# EAGLE design Stamp_Board (EAGLE 8.0.0)
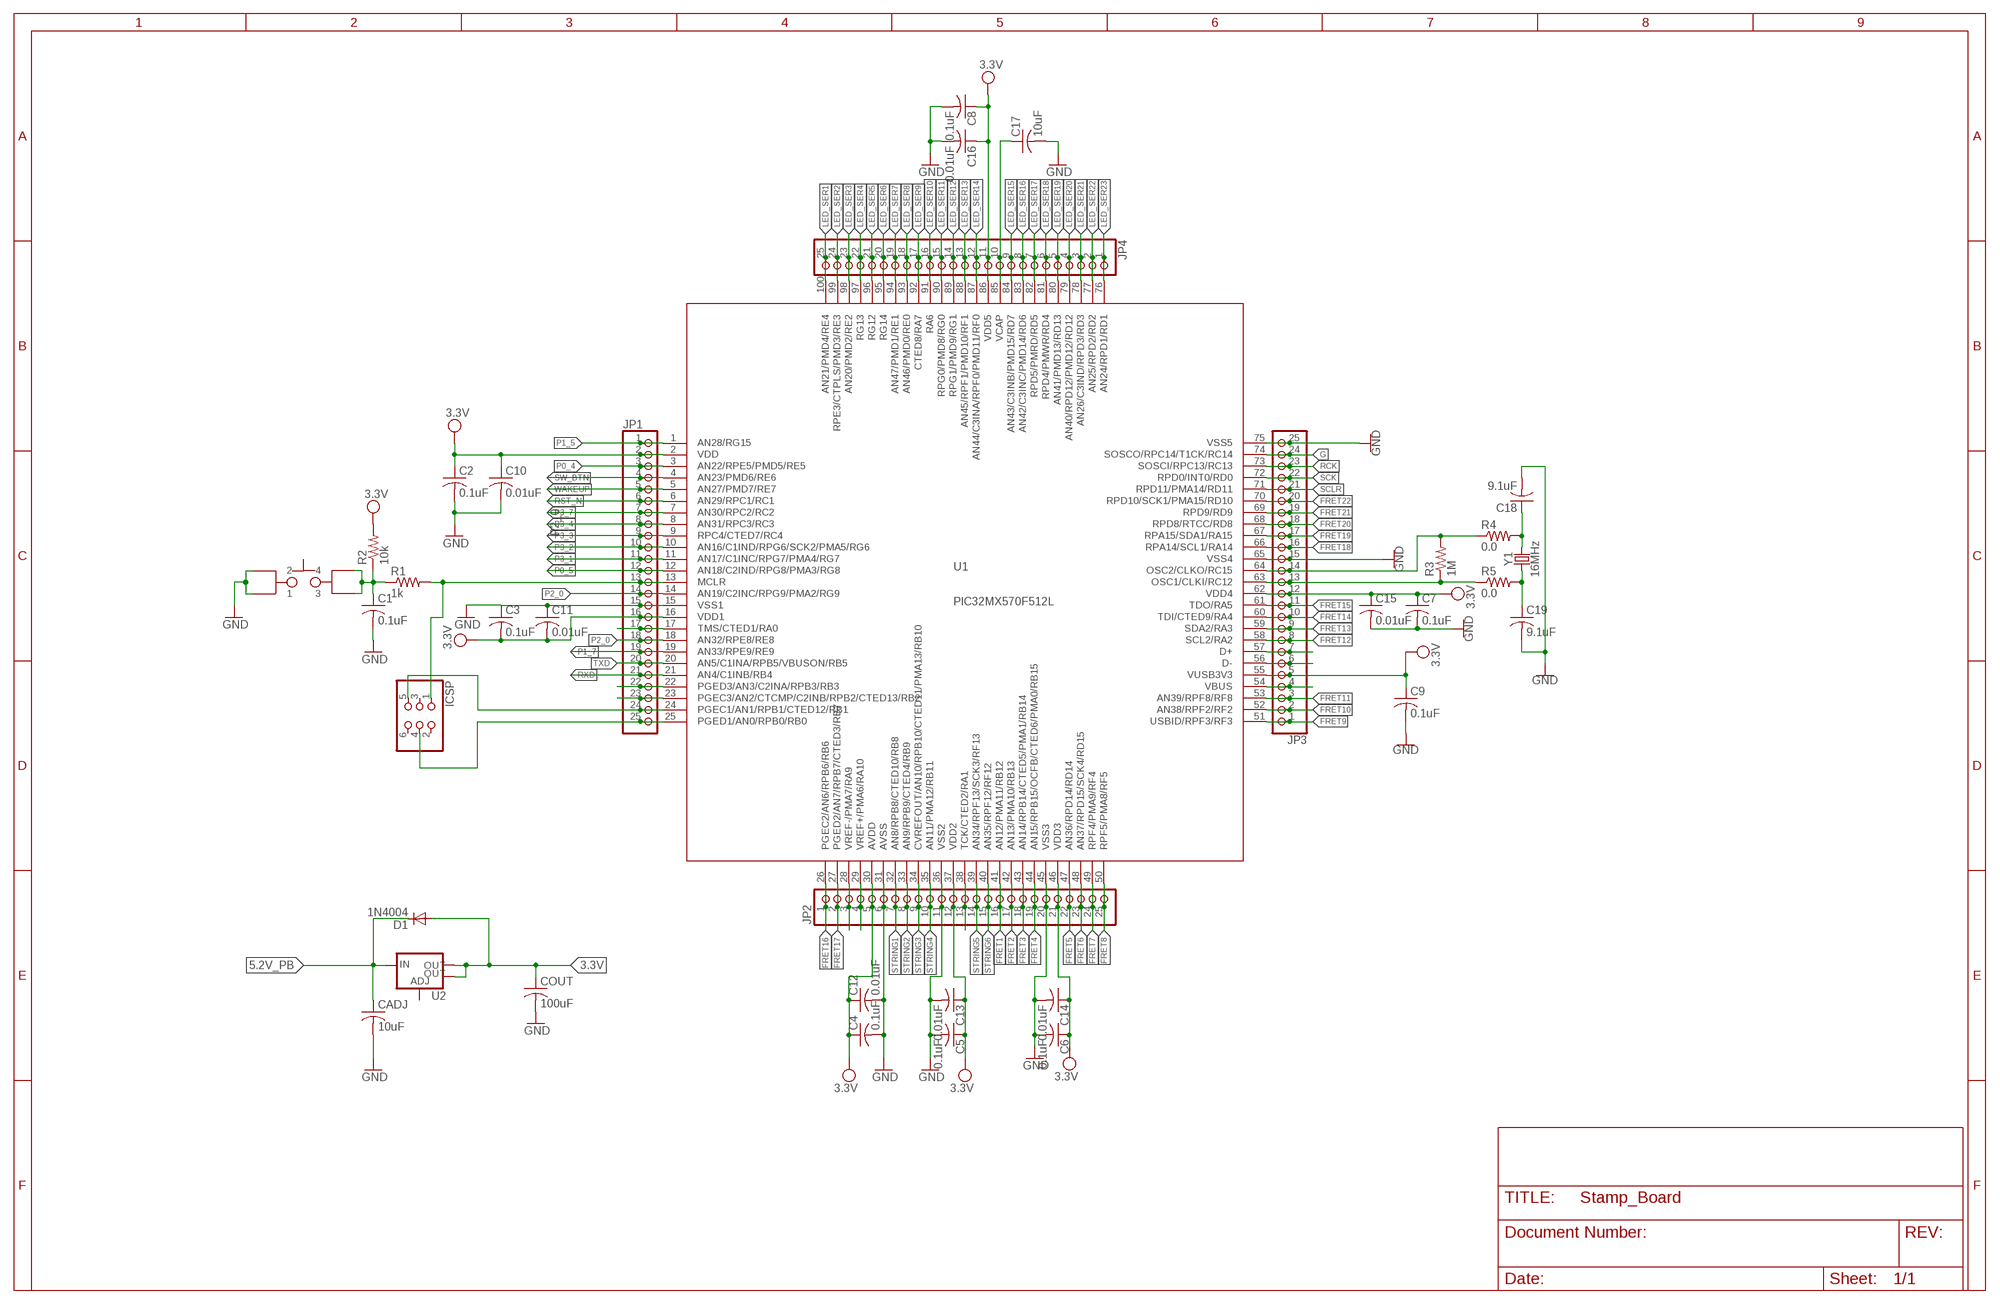
[diagram p0: schematic, sheet 1]

## Parts
C1  0.1uF  C-USC0805  [C0805]
C2  0.1uF  C-USC0805  [C0805]
C3  0.1uF  C-USC0805  [C0805]
C4  0.1uF  C-USC0805  [C0805]
C5  0.1uF  C-USC0805  [C0805]
C6  0.1uF  C-USC0805  [C0805]
C7  0.1uF  C-USC0805  [C0805]
C8  0.1uF  C-USC0805  [C0805]
C9  0.1uF  C-USC0805  [C0805]
C10  0.01uF  C-USC0805  [C0805]
C11  0.01uF  C-USC0805  [C0805]
C12  0.01uF  C-USC0805  [C0805]
C13  0.01uF  C-USC0805  [C0805]
C14  0.01uF  C-USC0805  [C0805]
C15  0.01uF  C-USC0805  [C0805]
C16  0.01uF  C-USC0805  [C0805]
C17  10uF  C-USC0805  [C0805]
C18  9.1uF  C-USC0805  [C0805]
C19  9.1uF  C-USC0805  [C0805]
CADJ  10uF  C-USC0805  [C0805]
COUT  100uF  C-USC0805  [C0805]
D1  1N4004  [DO41-10]
ICSP  PINHD-2X3  [2X03]
JP1  PINHD-1X25  [1X25]
JP2  PINHD-1X25  [1X25]
JP3  PINHD-1X25  [1X25]
JP4  PINHD-1X25  [1X25]
R1  1k  R-US_M0805  [M0805]
R2  10k  R-US_M0805  [M0805]
R3  1M  R-US_M0805  [M0805]
R4  0.0  R-US_R0805  [R0805]
R5  0.0  R-US_R0805  [R0805]
S1  LL3301NF065QG  [LL3301NF065QG]
U1  PIC32MX570F512L  [TQFP100-14X14]
U2  V_REG_LM1117SOT223  [SOT223]
Y1  16MHz  CRYSTALSMD-5X3.2-2PAD  [CRYSTAL-SMD-5X3.2-2PAD]

## Nets
3.3V: COUT.1 D1.A U2.2(OUT) U2.4(OUT)
5.2V_PB: CADJ.1 D1.C U2.3(IN)
FRET1: JP2.16 U1.41(AN12/PMA11/RB12)
FRET2: JP2.17 U1.42(AN13/PMA10/RB13)
FRET3: JP2.18 U1.43(AN14/RPB14/CTED5/PMA1/RB14)
FRET4: JP2.19 U1.44(AN15/RPB15/OCFB/CTED6/PMA0/RB15)
FRET5: JP2.22 U1.47(AN36/RPD14/RD14)
FRET6: JP2.23 U1.48(AN37/RPD15/SCK4/RD15)
FRET7: JP2.24 U1.49(RPF4/PMA9/RF4)
FRET8: JP2.25 U1.50(RPF5/PMA8/RF5)
FRET9: JP3.1 U1.51(USBID/RPF3/RF3)
FRET10: JP3.2 U1.52(AN38/RPF2/RF2)
FRET11: JP3.3 U1.53(AN39/RPF8/RF8)
FRET12: JP3.8 U1.58(SCL2/RA2)
FRET13: JP3.9 U1.59(SDA2/RA3)
FRET14: JP3.10 U1.60(TDI/CTED9/RA4)
FRET15: JP3.11 U1.61(TDO/RA5)
FRET16: JP2.1 U1.26(PGEC2/AN6/RPB6/RB6)
FRET17: JP2.2 U1.27(PGED2/AN7/RPB7/CTED3/RB7)
FRET18: JP3.16 U1.66(RPA14/SCL1/RA14)
FRET19: JP3.17 U1.67(RPA15/SDA1/RA15)
FRET20: JP3.18 U1.68(RPD8/RTCC/RD8)
FRET21: JP3.19 U1.69(RPD9/RD9)
FRET22: JP3.20 U1.70(RPD10/SCK1/PMA15/RD10)
G: JP3.24 U1.74(SOSCO/RPC14/T1CK/RC14)
GND: C1.2 C2.2 C3.1 C4.2 C5.2 C6.2 C7.2 C8.2 C9.2 C10.2 C11.1 C12.2 C13.2 C14.2 C15.2 C16.2 C17.2 C18.2 C19.2 CADJ.2 COUT.2 JP1.15 JP2.6 JP2.11 JP2.20 JP3.15 JP3.25 S1.P$1 S1.P$2 U1.15(VSS1) U1.31(AVSS) U1.36(VSS2) U1.45(VSS3) U1.65(VSS4) U1.75(VSS5)
LED_SER1: JP4.25 U1.100(AN21/PMD4/RE4)
LED_SER2: JP4.24 U1.99(RPE3/CTPLS/PMD3/RE3)
LED_SER3: JP4.23 U1.98(AN20/PMD2/RE2)
LED_SER4: JP4.22 U1.97(RG13)
LED_SER5: JP4.21 U1.96(RG12)
LED_SER6: JP4.20 U1.95(RG14)
LED_SER7: JP4.19 U1.94(AN47/PMD1/RE1)
LED_SER8: JP4.18 U1.93(AN46/PMD0/RE0)
LED_SER9: JP4.17 U1.92(CTED8/RA7)
LED_SER10: JP4.16 U1.91(RA6)
LED_SER11: JP4.15 U1.90(RPG0/PMD8/RG0)
LED_SER12: JP4.14 U1.89(RPG1/PMD9/RG1)
LED_SER13: JP4.13 U1.88(AN45/RPF1/PMD10/RF1)
LED_SER14: JP4.12 U1.87(AN44/C3INA/RPF0/PMD11/RF0)
LED_SER15: JP4.9 U1.84(AN43/C3INB/PMD15/RD7)
LED_SER16: JP4.8 U1.83(AN42/C3INC/PMD14/RD6)
LED_SER17: JP4.7 U1.82(RPD5/PMRD/RD5)
LED_SER18: JP4.6 U1.81(RPD4/PMWR/RD4)
LED_SER19: JP4.5 U1.80(AN41/PMD13/RD13)
LED_SER20: JP4.4 U1.79(AN40/RPD12/PMD12/RD12)
LED_SER21: JP4.3 U1.78(AN26/C3IND/RPD3/RD3)
LED_SER22: JP4.2 U1.77(AN25/RPD2/RD2)
LED_SER23: JP4.1 U1.76(AN24/RPD1/RD1)
N$1: JP3.14 R3.2 R4.1 U1.64(OSC2/CLKO/RC15)
N$2: ICSP.5 JP1.24 U1.24(PGEC1/AN1/RPB1/CTED12/RB1)
N$3: JP1.17 U1.17(TMS/CTED1/RA0)
N$4: JP1.22 U1.22(PGED3/AN3/C2INA/RPB3/RB3)
N$5: JP1.23 U1.23(PGEC3/AN2/CTCMP/C2INB/RPB2/CTED13/RB2)
N$6: C18.1 R4.2 Y1.P$2
N$8: C19.1 R5.2 Y1.P$1
N$12: C17.1 JP4.10 U1.85(VCAP)
N$13: ICSP.1 JP1.13 R1.2 U1.13(MCLR)
N$14: ICSP.4 JP1.25 U1.25(PGED1/AN0/RPB0/RB0)
N$15: JP3.13 R3.1 R5.1 U1.63(OSC1/CLKI/RC12)
N$16: C1.1 R1.1 R2.1 S1.P$3 S1.P$4
N$44: JP2.3 U1.28(VREF-/PMA7/RA9)
N$45: JP2.4 U1.29(VREF+/PMA6/RA10)
N$52: JP2.13 U1.38(TCK/CTED2/RA1)
N$66: JP3.4 U1.54(VBUS)
N$67: JP3.6 U1.56(D-)
N$68: JP3.7 U1.57(D+)
P0_4: JP1.3 U1.3(AN22/RPE5/PMD5/RE5)
P0_5: JP1.12 U1.12(AN18/C2IND/RPG8/PMA3/RG8)
P1_5: JP1.1 U1.1(AN28/RG15)
P1_7: JP1.19 U1.19(AN33/RPE9/RE9)
P2_0: JP1.14 JP1.18 U1.14(AN19/C2INC/RPG9/PMA2/RG9) U1.18(AN32/RPE8/RE8)
P3_1: JP1.11 U1.11(AN17/C1INC/RPG7/PMA4/RG7)
P3_2: JP1.10 U1.10(AN16/C1IND/RPG6/SCK2/PMA5/RG6)
P3_3: JP1.9 U1.9(RPC4/CTED7/RC4)
P3_4: JP1.8 U1.8(AN31/RPC3/RC3)
P3_7: JP1.7 U1.7(AN30/RPC2/RC2)
RCK: JP3.23 U1.73(SOSCI/RPC13/RC13)
RST_N: JP1.6 U1.6(AN29/RPC1/RC1)
RXD: JP1.21 U1.21(AN4/C1INB/RB4)
SCK: JP3.22 U1.72(RPD0/INT0/RD0)
SCLR: JP3.21 U1.71(RPD11/PMA14/RD11)
STRING1: JP2.7 U1.32(AN8/RPB8/CTED10/RB8)
STRING2: JP2.8 U1.33(AN9/RPB9/CTED4/RB9)
STRING3: JP2.9 U1.34(CVREFOUT/AN10/RPB10/CTED11/PMA13/RB10)
STRING4: JP2.10 U1.35(AN11/PMA12/RB11)
STRING5: JP2.14 U1.39(AN34/RPF13/SCK3/RF13)
STRING6: JP2.15 U1.40(AN35/RPF12/RF12)
SW_BTN: JP1.4 U1.4(AN23/PMD6/RE6)
TXD: JP1.20 U1.20(AN5/C1INA/RPB5/VBUSON/RB5)
VDD: C2.1 C3.2 C4.1 C5.1 C6.1 C7.1 C8.1 C9.1 C10.1 C11.2 C12.1 C13.1 C14.1 C15.1 C16.1 JP1.2 JP1.16 JP2.5 JP2.12 JP2.21 JP3.5 JP3.12 JP4.11 R2.2 U1.2(VDD) U1.16(VDD1) U1.30(AVDD) U1.37(VDD2) U1.46(VDD3) U1.55(VUSB3V3) U1.62(VDD4) U1.86(VDD5) ; supply symbol labelled 3.3V
WAKEUP: JP1.5 U1.5(AN27/PMD7/RE7)
Unconnected: ICSP.2 ICSP.3 ICSP.6 U2.1(ADJ)

## Library data of the parts
C1-C19 CADJ COUT = rcl:C-US: CAPACITOR, American symbol
D1 = diode:1N4004: DIODE general purpose rectifier, 1 A
ICSP = pinhead:PINHD-2X3: PIN HEADER
JP1-JP4 = pinhead:PINHD-1X25: PIN HEADER
R1-R5 = rcl:R-US_: RESISTOR, American symbol
S1 = ECE477_Guitutar:LL3301NF065QG
U1 = PICMX5xx:PIC32MX570F512L
U2 = SparkFun-IC-Power:V_REG_LM1117: Voltage Regulator LM1117 Standard adjustable voltage regulator but in SMD form. Spark Fun Electronics SKU : COM-00595; PROD_ID: VREG-08170
Y1 = SparkFun-Clocks:CRYSTAL: Crystals (Generic) These are passive quartz crystals, which can be used as a clock source for a microcontroller. Crystal's are two-terminal devices. They require external "load" capacitors to generate an oscillating signal.

## Board
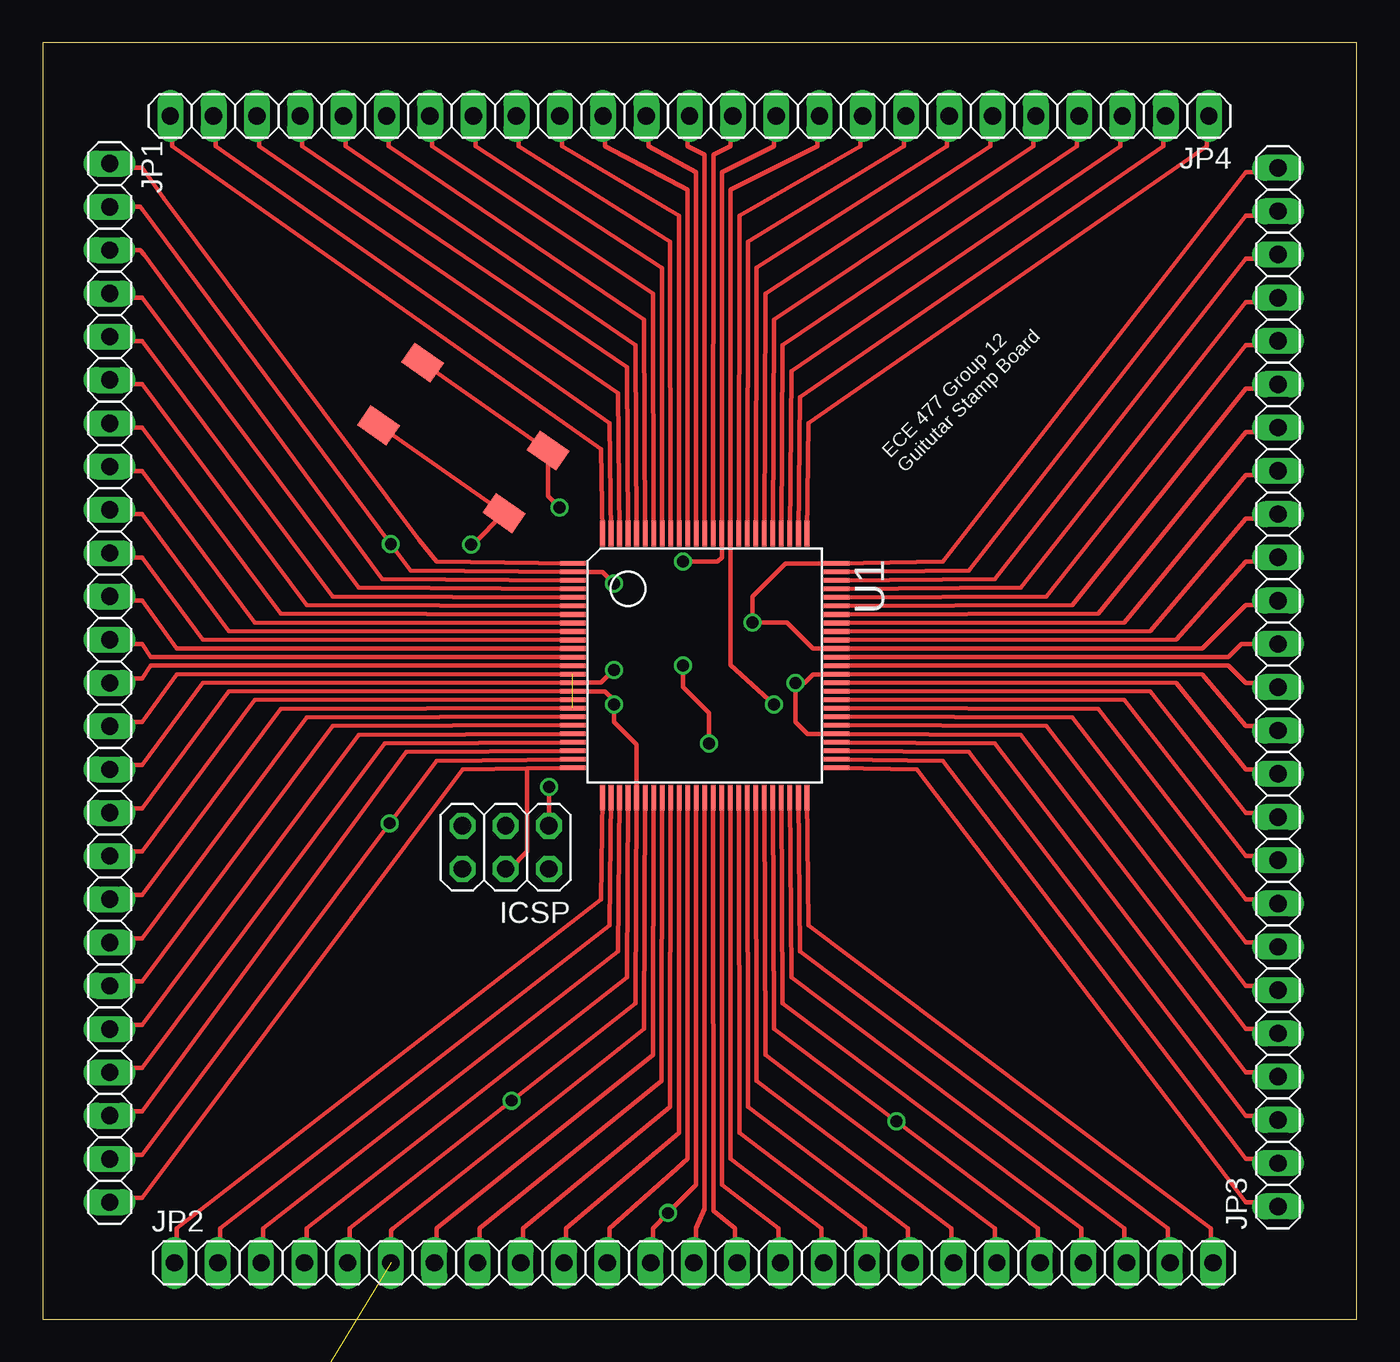
[diagram p1: board, top side]
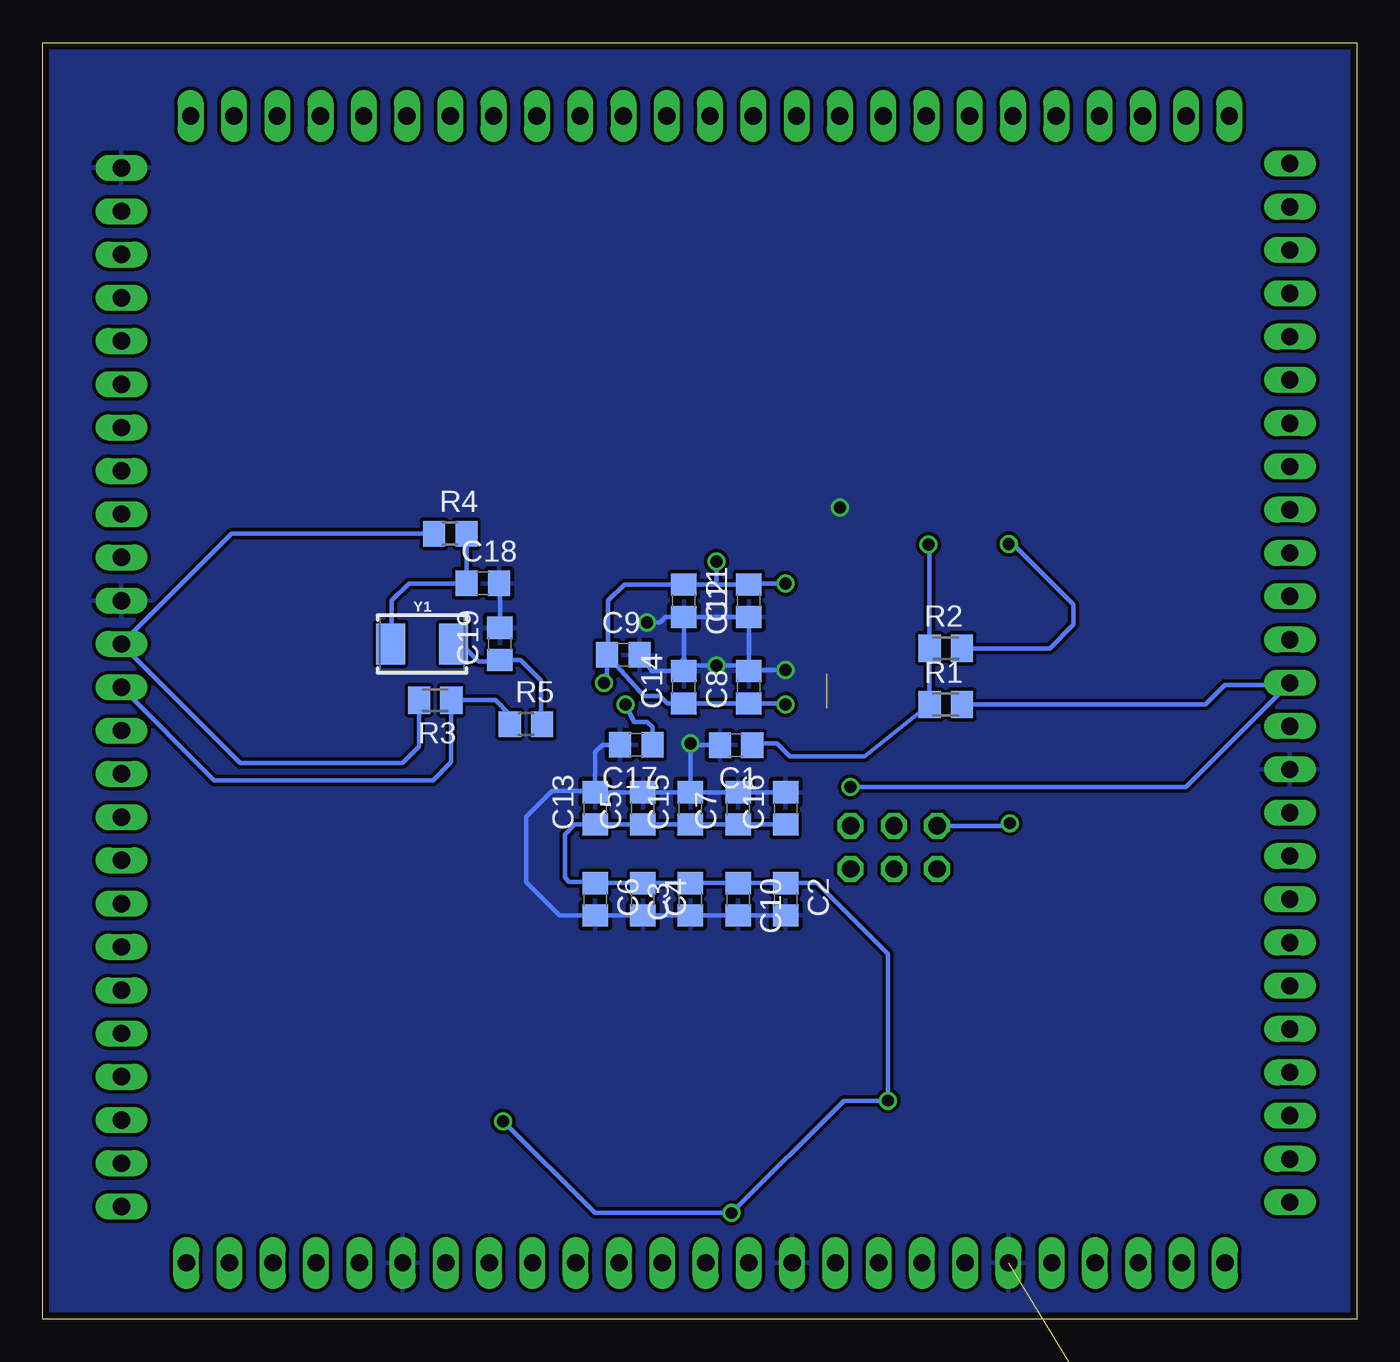
[diagram p2: board, bottom side, seen from below]

Size 77.14 x 74.92 mm. Coordinates in mm from the lower left corner, seen from the top.
Outline: 0,0 77.14,0 77.14,74.92 0,74.92 0,0
Copper layers (1*16): Top 0.0356mm / dielectric 1.5011mm / Bottom 0.0356mm
Design rules "ECE_Senior_Design": minimum track width 8mil, minimum drill 13mil, track to track 8mil, track to pad 8mil, pad to pad 6mil, via to via 8mil, smd to smd 6mil, copper to edge 15mil, drill to drill 8mil, minimum pad ring 7mil, minimum via ring 7mil, stop-mask expansion 3mil, vias tented up to drill 0mil, thermal gap 10mil

### Footprints (pad centres in the part's own frame; a part is rotated, then mirrored left to right if it is on the bottom)
C0805 = smd 1.3 x 1.5: 1 -0.95,0; 2 0.95,0
DO41-10 = drill 1.118: A 5.08,0; C -5.08,0
2X03 = drill 1.016 octagon: 1 -2.54,-1.27; 2 -2.54,1.27; 3 0,-1.27; 4 0,1.27; 5 2.54,-1.27; 6 2.54,1.27
1X25 = drill 1.016 long: 1 -29.21,0; 2 -26.67,0; 3 -24.13,0; 4 -21.59,0; 5 -19.05,0; 6 -16.51,0; 7 -13.97,0; 8 -11.43,0; 9 -8.89,0; 10 -6.35,0; 11 -3.81,0; 12 -1.27,0; 13 1.27,0; 14 3.81,0; 15 6.35,0; 16 8.89,0; 17 11.43,0; 18 13.97,0; 19 16.51,0; 20 19.05,0; 21 21.59,0; 22 24.13,0; 23 26.67,0; 24 29.21,0; 25 31.75,0
M0805 = smd 1.3 x 1.6: 1 -0.95,0; 2 0.95,0
R0805 = smd 1.3 x 1.5: 1 -0.95,0; 2 0.95,0
LL3301NF065QG = smd 2.1 x 1.4: P$1 -4.4,2.2; P$2 4.6,2.2; P$3 -4.4,-2.3; P$4 4.6,-2.3
TQFP100-14X14 = smd 0.27 x 1.5: 1 -6,-7.75; 2 -5.5,-7.75; 3 -5,-7.75; 4 -4.5,-7.75; 5 -4,-7.75; 6 -3.5,-7.75; 7 -3,-7.75; 8 -2.5,-7.75; 9 -2,-7.75; 10 -1.5,-7.75; 11 -1,-7.75; 12 -0.5,-7.75; 13 0,-7.75; 14 0.5,-7.75; 15 1,-7.75; 16 1.5,-7.75; 17 2,-7.75; 18 2.5,-7.75; 19 3,-7.75; 20 3.5,-7.75; 21 4,-7.75; 22 4.5,-7.75; 23 5,-7.75; 24 5.5,-7.75; 25 6,-7.75; 51 6,7.75; 52 5.5,7.75; 53 5,7.75; 54 4.5,7.75; 55 4,7.75; 56 3.5,7.75; 57 3,7.75; 58 2.5,7.75; 59 2,7.75; 60 1.5,7.75; 61 1,7.75; 62 0.5,7.75; 63 0,7.75; 64 -0.5,7.75; 65 -1,7.75; 66 -1.5,7.75; 67 -2,7.75; 68 -2.5,7.75; 69 -3,7.75; 70 -3.5,7.75; 71 -4,7.75; 72 -4.5,7.75; 73 -5,7.75; 74 -5.5,7.75; 75 -6,7.75 | smd 1.5 x 0.27: 26 7.75,-6; 27 7.75,-5.5; 28 7.75,-5; 29 7.75,-4.5; 30 7.75,-4; 31 7.75,-3.5; 32 7.75,-3; 33 7.75,-2.5; 34 7.75,-2; 35 7.75,-1.5; 36 7.75,-1; 37 7.75,-0.5; 38 7.75,0; 39 7.75,0.5; 40 7.75,1; 41 7.75,1.5; 42 7.75,2; 43 7.75,2.5; 44 7.75,3; 45 7.75,3.5; 46 7.75,4; 47 7.75,4.5; 48 7.75,5; 49 7.75,5.5; 50 7.75,6; 76 -7.75,6; 77 -7.75,5.5; 78 -7.75,5; 79 -7.75,4.5; 80 -7.75,4; 81 -7.75,3.5; 82 -7.75,3; 83 -7.75,2.5; 84 -7.75,2; 85 -7.75,1.5; 86 -7.75,1; 87 -7.75,0.5; 88 -7.75,0; 89 -7.75,-0.5; 90 -7.75,-1; 91 -7.75,-1.5; 92 -7.75,-2; 93 -7.75,-2.5; 94 -7.75,-3; 95 -7.75,-3.5; 96 -7.75,-4; 97 -7.75,-4.5; 98 -7.75,-5; 99 -7.75,-5.5; 100 -7.75,-6
SOT223 = smd 1.219 x 2.235: 1 -2.311,-3.099; 2 0,-3.099; 3 2.311,-3.099 | smd 3.6 x 2.2: 4 0,3.099
CRYSTAL-SMD-5X3.2-2PAD = smd 1.7 x 2.4: P$1 1.85,0; P$2 -1.85,0

### Placement (x,y rotation side)
C1  36.44,33.68 180 bottom
C2  33.53,24.64 270 bottom
C3  39.12,24.64 90 bottom
C4  41.91,24.64 270 bottom
C5  41.91,29.97 90 bottom
C6  44.7,24.64 270 bottom
C7  36.32,29.97 90 bottom
C8  35.69,37.08 90 bottom
C9  43.05,38.99 0 bottom
C10  36.32,24.64 270 bottom
C11  35.69,42.16 90 bottom
C12  39.5,42.16 270 bottom
C13  44.7,29.97 90 bottom
C14  39.5,37.08 90 bottom
C15  39.12,29.97 90 bottom
C16  33.53,29.97 90 bottom
C17  42.3,33.7 180 bottom
C18  51.31,43.18 0 bottom
C19  50.29,39.62 90 bottom
CADJ  -1.65,-37.59 0 top  (outside the outline)
COUT  -1.65,-31.5 0 top  (outside the outline)
D1  9.78,-49.02 0 top  (outside the outline)
ICSP  27.18,27.69 180 top
JP1  3.94,38.61 270 top
JP2  36.96,3.3 0 top
JP3  72.52,35.81 90 top
JP4  39.24,70.61 180 top
R1  24.13,36.07 0 bottom
R2  24.13,39.37 0 bottom
R3  54.1,36.32 180 bottom
R4  53.21,46.1 0 bottom
R5  48.77,34.92 0 bottom
S1  24.64,51.82 325 top
U1  38.86,38.35 270 top
U2  2.41,-9.4 0 top  (outside the outline)
Y1  54.86,39.62 0 bottom

### Tracks (layer width: path | path; a pad name or v marks a point on that pad's centre or on a via)
3.3V  (3 unrouted)
5.2V_PB  (2 unrouted)
FRET1
  Top 0.254: JP2.16 45.72,3.43 45.72,5.33 40.39,9.4 U1.41
FRET2
  Top 0.254: JP2.17 48.26,3.43 48.26,5.33 40.89,10.92 U1.42
FRET3
  Top 0.254: JP2.18 50.8,3.43 50.8,5.33 41.4,12.45 U1.43
FRET4
  Top 0.254: JP2.19 53.34,3.43 53.34,5.33 41.91,13.97 U1.44
FRET5
  Top 0.254: JP2.22 60.96,3.43 60.96,5.33 43.43,18.54 U1.47
FRET6
  Top 0.254: JP2.23 63.5,3.43 63.5,5.33 43.94,20.07 U1.48
FRET7
  Top 0.254: JP2.24 66.04,3.43 66.04,5.33 44.45,21.59 U1.49
FRET8
  Top 0.254: JP2.25 68.58,3.43 68.58,5.33 44.96,23.11 U1.50
FRET9
  Top 0.254: JP3.1 72.26,6.86 70.61,6.86 51.31,32.26 U1.51
FRET10
  Top 0.254: JP3.2 72.26,9.4 70.61,9.4 52.83,32.77 U1.52
FRET11
  Top 0.254: JP3.3 72.26,11.94 70.61,11.94 54.36,33.27 U1.53
FRET12
  Top 0.254: JP3.8 72.26,24.64 70.61,24.64 61.98,35.81 U1.58
FRET13
  Top 0.254: JP3.9 72.26,27.18 70.61,27.18 63.5,36.32 U1.59
FRET14
  Top 0.254: JP3.10 72.26,29.72 70.61,29.72 65.02,36.83 U1.60
FRET15
  Top 0.254: JP3.11 72.26,32.26 70.61,32.26 66.55,37.34 U1.61
FRET16
  Top 0.254: JP2.1 7.87,3.43 7.87,5.33 32.77,24.64 U1.26
FRET17
  Top 0.254: JP2.2 10.41,3.43 10.41,5.33 33.27,23.11 U1.27
FRET18
  Top 0.254: JP3.16 72.26,44.45 70.61,44.45 66.55,39.88 U1.66
FRET19
  Top 0.254: JP3.17 72.26,46.99 70.61,46.99 65.02,40.39 U1.67
FRET20
  Top 0.254: JP3.18 72.26,49.53 70.61,49.53 63.5,40.89 U1.68
FRET21
  Top 0.254: JP3.19 72.26,52.07 70.61,52.07 61.98,41.4 U1.69
FRET22
  Top 0.254: JP3.20 72.26,54.61 70.61,54.61 60.45,41.91 U1.70
G
  Top 0.254: JP3.24 72.26,64.77 70.61,64.77 54.36,43.94 U1.74
GND  (via drill 0.7)  (2 unrouted)
  Top 0.254: S1.P$1 S1.P$2 29.67,48.31 v30.35,47.62 | JP1.15 4.19,32.51 5.84,32.51 9.4,37.34 U1.15 32.78,37.35 v33.53,38.1 | U1.31 35.31,17.02 33.84,15.86 20.57,5.33 20.45,5.21 JP2.6 | JP2.20 55.88,3.43 55.88,5.33 45.3,13.32 42.42,15.49 U1.45 | JP2.11 33.27,3.43 33.27,5.33 36.9,8.56 37.85,9.4 U1.36 | JP3.25 72.26,67.31 70.61,67.31 52.83,44.45 U1.75 43.59,44.35 41.66,42.42 v41.66,40.89 43.69,40.89 45.23,39.35 U1.65 68.07,39.37 70.61,41.91 72.26,41.91 JP3.15 | v39.12,33.78 39.12,35.56 37.59,37.08 v37.59,38.35
  Bottom 0.254: C2.2 C10.2 C3.1 C4.2 C6.2 46.8,23.69 48.77,25.65 48.77,29.46 47.24,30.99 44.77,30.99 C13.2 | C13.2 C5.2 C15.2 | C15.2 C7.2 C16.2 | 38.91,31.13 C15.2 | C17.2 44.27,33.7 44.7,33.27 C13.2 | C8.2 C11.1 C12.2 | C14.2 C12.2 | C12.2 40.57,41.21 40.89,40.89 v41.66,40.89 | C14.2 41.4,38.03 C9.2 | v33.53,38.1 35.62,38.1 C8.2 | C19.2 50.29,43.11 C18.2 | C1.2 39.02,33.68 v39.12,33.78 C15.2 | C8.2 36.01,38.35 v37.59,38.35 39.18,38.35 C14.2
  Bottom 0.406: C14.2 39.5,38.67
  pour Bottom: 0,0 0,74.93 77.22,74.93 77.22,0
LED_SER1
  Top 0.254: JP4.25 7.62,70.48 7.62,68.83 32.77,51.05 U1.100
LED_SER2
  Top 0.254: JP4.24 10.16,70.48 10.16,68.83 33.27,52.58 U1.99
LED_SER3
  Top 0.254: JP4.23 12.7,70.48 12.7,68.83 33.78,54.36 U1.98
LED_SER4
  Top 0.254: JP4.22 15.24,70.48 15.24,68.83 34.29,55.88 U1.97
LED_SER5
  Top 0.254: JP4.21 17.78,70.48 17.78,68.83 34.8,57.15 U1.96
LED_SER6
  Top 0.254: JP4.20 20.32,70.48 20.32,68.83 35.31,58.67 U1.95
LED_SER7
  Top 0.254: JP4.19 22.86,70.48 22.86,68.83 35.81,60.2 U1.94
LED_SER8
  Top 0.254: JP4.18 25.4,70.48 25.4,68.83 36.32,61.72 36.36,61.68 U1.93
LED_SER9
  Top 0.254: JP4.17 27.94,70.48 27.94,68.83 36.83,63.25 U1.92
LED_SER10
  Top 0.254: JP4.16 30.48,70.48 30.48,68.83 37.34,64.77 U1.91
LED_SER11
  Top 0.254: JP4.15 33.02,70.48 33.02,68.83 37.85,66.29 U1.90
LED_SER12
  Top 0.254: JP4.14 35.56,70.48 35.56,68.83 38.35,67.31 U1.89
LED_SER13
  Top 0.254: JP4.13 37.85,70.48 37.85,68.83 38.86,68.33 U1.88
LED_SER14
  Top 0.254: JP4.12 40.39,70.48 40.39,68.83 39.37,68.33 U1.87
LED_SER15
  Top 0.254: JP4.9 48.01,70.48 48.01,68.83 40.89,64.77 U1.84
LED_SER16
  Top 0.254: JP4.8 50.55,70.48 50.55,68.83 41.4,63.25 U1.83
LED_SER17
  Top 0.254: JP4.7 53.09,70.48 53.09,68.83 41.91,61.72 U1.82
LED_SER18
  Top 0.254: JP4.6 55.63,70.48 55.63,68.83 42.42,60.2 U1.81
LED_SER19
  Top 0.254: JP4.5 58.17,70.48 58.17,68.83 42.93,58.67 U1.80
LED_SER20
  Top 0.254: JP4.4 60.71,70.48 60.71,68.83 43.43,57.15 U1.79
LED_SER21
  Top 0.254: JP4.3 63.25,70.48 63.25,68.83 43.94,55.63 U1.78
LED_SER22
  Top 0.254: JP4.2 65.79,70.48 65.79,68.83 44.45,54.1 U1.77
LED_SER23
  Top 0.254: JP4.1 68.33,70.48 68.33,68.83 44.96,52.58 U1.76
N$1
  Top 0.254: JP3.14 70.36,39.62 69.6,38.86 46.62,38.86 U1.64
  Bottom 0.254: R3.2 55.05,33.59 56.01,32.64 65.53,32.64 JP3.14 66.04,46.1 R4.1
N$2  (via drill 0.7)
  Top 0.254: JP1.24 4.19,9.65 5.84,9.65 v20.38,29.1 23.11,32.77 U1.24
  Bottom 0.254: ICSP.5 20.52,28.96 v20.38,29.1
N$3
  Top 0.254: JP1.17 4.19,27.43 5.84,27.43 12.45,36.32 U1.17
N$4
  Top 0.254: JP1.22 4.19,14.73 5.84,14.73 20.07,33.78 U1.22
N$5
  Top 0.254: JP1.23 4.19,12.19 5.84,12.19 21.34,33.27 U1.23
N$6
  Bottom 0.254: Y1.P$2 56.64,39.7 56.64,42.16 55.63,43.18 C18.1 R4.2
N$8
  Bottom 0.254: R5.2 47.88,34.99 47.88,37.47 49.09,38.67 C19.1 50.36,38.61 51.56,38.61 52.58,39.62 Y1.P$1
N$12  (via drill 0.7)
  Top 0.254: JP4.10 45.47,70.48 45.47,68.83 40.39,66.29 U1.85 40.36,38.38 v42.93,36.07
  Bottom 0.254: C17.1 41.35,34.74 41.66,35.05 42.42,35.05 v42.93,36.07
N$13  (via drill 0.7)
  Top 0.254: U1.13 6.35,38.35 5.84,37.59 4.19,37.59 JP1.13 | ICSP.1 v29.72,31.24
  Bottom 0.254: v29.72,31.24 10.03,31.24 JP1.13 4.06,37.21 7.75,37.21 8.89,36.07 R1.2
N$14
  Top 0.254: JP1.25 4.19,7.11 5.84,7.11 18.1,23.51 24.64,32.26 28.44,32.31 | 28.44,32.31 U1.25 | ICSP.4 27.43,26.42 28.45,27.43 28.45,32.31 28.44,32.31
N$15
  Top 0.254: JP3.13 72.26,37.34 70.61,37.34 69.6,38.35 U1.63
  Bottom 0.254: 53.01,36.46 R3.1 | R5.1 49.72,35.49 50.55,36.32 R3.1 | R3.1 53.15,32.7 54.23,31.62 67.06,31.62 JP3.13
N$16  (via drill 0.7)
  Top 0.254: S1.P$3 S1.P$4 25.26,45.47 v25.15,45.47
  Bottom 0.254: C1.1 35.39,33.78 34.04,33.78 33.27,33.02 28.89,33.02 R1.1 R2.1 25.08,45.4 v25.15,45.47
N$44
  Top 0.254: JP2.3 12.95,3.43 12.95,5.33 33.78,21.59 U1.28
N$45
  Top 0.254: JP2.4 15.49,3.43 15.49,5.33 34.29,20.07 U1.29
N$52
  Top 0.254: U1.38 38.86,6.48 38.35,5.33 38.35,3.43 JP2.13
N$66
  Top 0.254: JP3.4 72.26,14.48 70.61,14.48 55.88,33.78 U1.54
N$67
  Top 0.254: JP3.6 72.26,19.56 70.61,19.56 58.93,34.8 U1.56
N$68
  Top 0.254: JP3.7 72.26,22.1 70.61,22.1 60.45,35.31 U1.57
P0_4
  Top 0.254: JP1.3 5.71,62.74 5.97,62.48 19.94,43.43 U1.3
P0_5
  Top 0.254: JP1.12 4.19,39.62 5.84,39.62 6.36,38.85 U1.12
P1_5
  Top 0.254: JP1.1 4.19,67.56 5.84,67.56 7.11,65.79 22.1,45.72 23.11,44.45 U1.1
P1_7
  Top 0.254: JP1.19 4.19,22.35 5.84,22.35 15.49,35.31 U1.19
P2_0  (1 unrouted)
  Top 0.254: JP1.14 4.19,35.05 5.84,35.05 7.87,37.85 U1.14 | JP1.18 4.19,24.89 5.84,24.89 13.97,35.81 U1.18
P3_1
  Top 0.254: JP1.11 4.19,42.16 5.84,42.16 7.87,39.37 U1.11
P3_2
  Top 0.254: JP1.10 4.19,44.7 5.84,44.7 9.4,39.88 U1.10
P3_3
  Top 0.254: JP1.9 4.19,47.24 5.84,47.24 10.92,40.39 U1.9
P3_4
  Top 0.254: JP1.8 4.19,49.78 5.84,49.78 12.45,40.89 U1.8
P3_7
  Top 0.254: JP1.7 4.19,52.32 5.84,52.32 13.97,41.4 U1.7
RCK
  Top 0.254: JP3.23 72.26,62.23 70.61,62.23 55.88,43.43 U1.73
RST_N
  Top 0.254: JP1.6 4.19,54.86 5.84,54.86 15.49,41.91 U1.6
RXD
  Top 0.254: JP1.21 4.19,17.27 5.84,17.27 18.54,34.29 U1.21
SCK
  Top 0.254: JP3.22 72.26,59.69 70.61,59.69 57.4,42.93 U1.72
SCLR
  Top 0.254: JP3.21 72.26,57.15 70.61,57.15 58.93,42.42 U1.71
STRING1
  Top 0.254: JP2.7 23.11,3.43 23.11,5.33 35.81,15.49 U1.32
STRING2
  Top 0.254: JP2.8 25.65,3.43 25.65,5.33 36.32,13.97 U1.33
STRING3
  Top 0.254: JP2.9 28.19,3.43 28.19,5.33 36.83,12.45 U1.34
STRING4
  Top 0.254: JP2.10 30.73,3.43 30.73,5.33 37.34,10.92 U1.35
STRING5
  Top 0.254: U1.39 39.36,28.33 39.37,6.35 40.64,5.33 40.64,3.43 JP2.14
STRING6
  Top 0.254: JP2.15 43.18,3.43 43.18,5.33 39.88,7.87 U1.40
SW_BTN
  Top 0.254: JP1.4 4.19,59.94 5.84,59.94 18.54,42.93 U1.4
TXD
  Top 0.254: JP1.20 4.19,19.81 5.84,19.81 17.02,34.8 U1.20
VDD  (via drill 0.7)
  Top 0.254: JP1.16 4.19,29.97 5.84,29.97 10.92,36.83 U1.16 31.14,36.83 33.02,36.83 33.53,36.32 v33.53,36.07 33.53,35.05 34.86,33.72 U1.30 34.8,18.54 v27.54,12.82 27.01,12.41 18.03,5.33 18.03,3.43 JP2.5 | JP2.21 58.42,3.43 58.42,5.33 v50.11,11.6 42.93,17.02 U1.46 | v33.53,43.18 32.85,43.85 U1.2 21.59,43.94 v20.44,45.49 5.84,65.15 5.71,65.28 JP1.2 | v37.59,44.45 39.62,44.45 39.86,44.69 U1.86 39.88,46.1 39.88,67.31 42.93,68.83 42.93,70.48 JP4.11 | JP2.12 35.81,3.43 35.81,5.33 v36.7,6.22 38.35,7.87 U1.37 | JP3.5 72.26,17.02 70.61,17.02 57.4,34.29 U1.55 44.89,34.35 44.2,35.05 v44.2,37.34 44.7,37.34 45.21,37.85 U1.62 68.07,37.85 70.61,34.8 72.26,34.8 JP3.12
  Bottom 0.254: 37.59,43.11 C11.2 35.62,43.18 v33.53,43.18 | 37.59,43.11 C12.1 42.99,43.11 43.94,42.16 43.94,39.05 C9.1 | C14.1 39.81,36.45 | v33.53,36.07 33.59,36.13 C8.1 C14.1 | v37.59,44.45 37.59,43.11 | 27.69,12.97 v27.54,12.82 | v27.54,12.82 27.54,21.44 31.68,25.59 C2.1 C10.1 C3.2 C4.1 C6.1 44.77,25.65 46.23,25.65 46.48,25.91 46.48,28.45 45.91,29.02 C13.1 C5.1 C15.1 C7.1 C16.1 | C14.1 40.45,36.13 40.89,36.58 41.84,36.58 C9.1 | v27.54,12.82 30.11,12.82 v36.7,6.22 44.73,6.22 v50.11,11.6 | C9.1 44,37.53 v44.2,37.34 | R2.2 18.03,39.37 16.64,40.77 16.64,41.94 20.34,45.63 20.34,45.6 v20.44,45.49
WAKEUP
  Top 0.254: JP1.5 4.19,57.4 5.84,57.4 17.02,42.42 U1.5

### Text on the board
tPlace: ECE 477 Group 12 / Guitutar Stamp Board